# Altium project BLE_ADS.PrjPcb
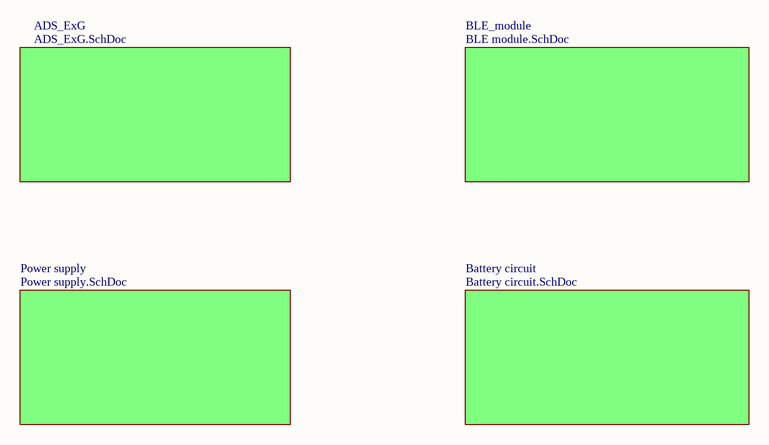
[diagram p0: BLE_ADS.SchDoc]
5 sheets, 104 parts. Net scope: global (net labels, ports and power ports of the same name join across sheets).
Board files: BLE_ADS_062819.PcbDoc, Power.PcbDoc, ADS.PcbDoc, BLE_ADS_ver02.PcbDoc
Sheets:
  BLE_ADS.SchDoc
    ADS_ExG = ADS_ExG.SchDoc
    BLE_module = BLE module.SchDoc
    Power supply = Power supply.SchDoc
    Battery circuit = Battery circuit.SchDoc

## Sheet BLE_ADS.SchDoc
size A

### Sub-sheets
ADS_ExG = ADS_ExG.SchDoc: no entries
Battery circuit = Battery circuit.SchDoc: no entries
BLE_module = BLE module.SchDoc: no entries
Power supply = Power supply.SchDoc: no entries

## Sheet ADS_ExG.SchDoc: ADS_ExG
size A; DrawnBy: Tai Le; Revision: Ver01
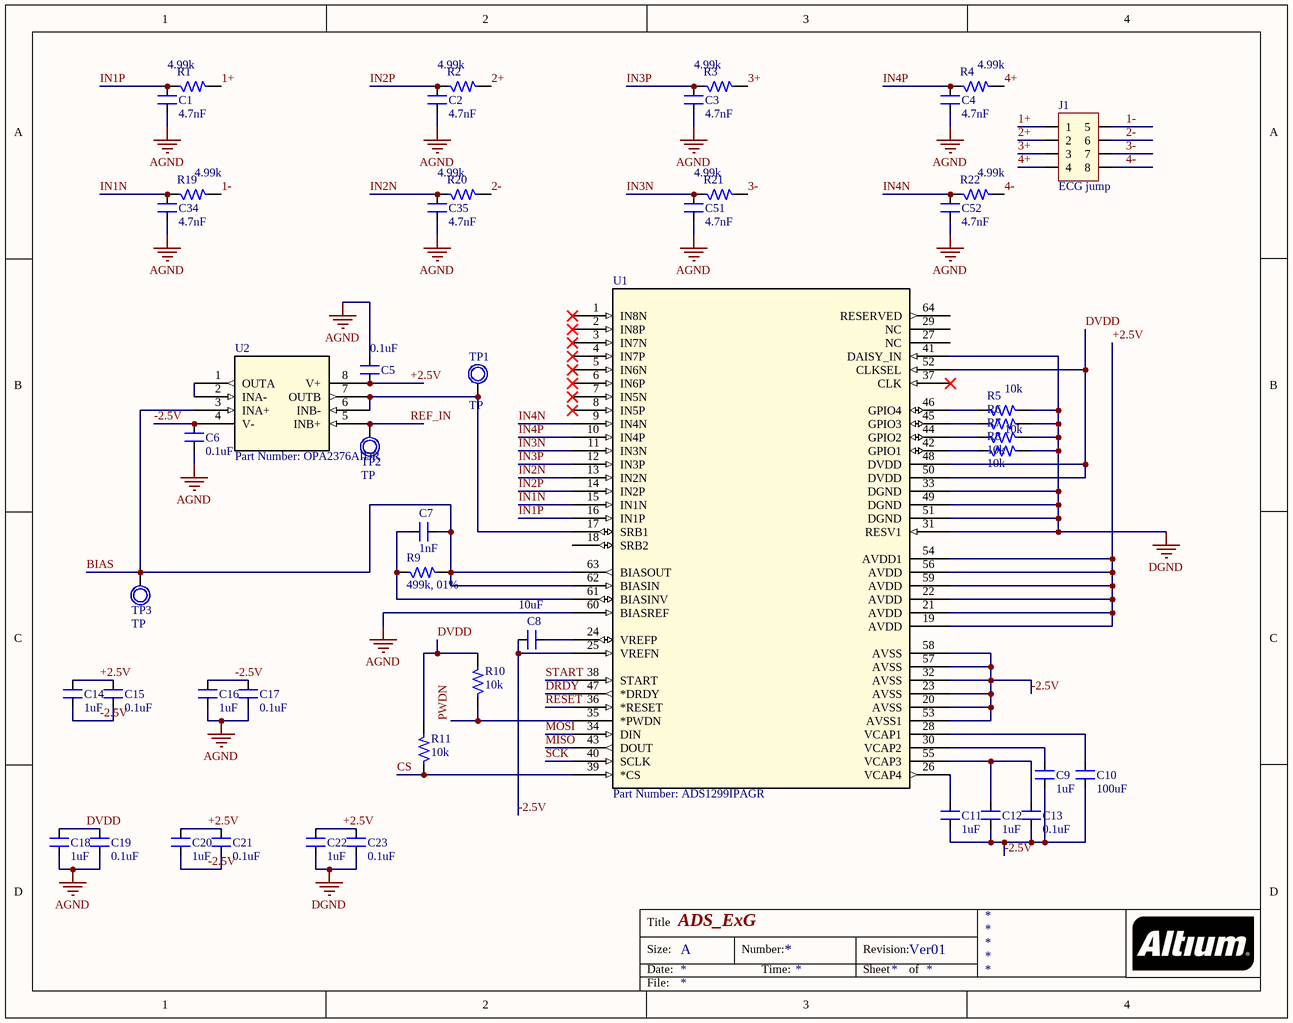
[diagram p1: ADS_ExG.SchDoc]

### Parts
C1  4.7nF  [SM-0805]
C2  4.7nF  [SM-0805]
C3  4.7nF  [SM-0805]
C4  4.7nF  [SM-0805]
C5  0.1uF  [SM-0805]
C6  0.1uF  [SM-0805]
C7  1nF  [SM-0805]
C8  10uF  [SM-0805]
C9  1uF  [SM-0805]
C10  100uF  [SM-0805]
C11  1uF  [SM-0805]
C12  1uF  [SM-0805]
C13  0.1uF  [SM-0805]
C14  1uF  [SM-0805]
C15  0.1uF  [SM-0805]
C16  1uF  [SM-0805]
C17  0.1uF  [SM-0805]
C18  1uF  [SM-0805]
C19  0.1uF  [SM-0805]
C20  1uF  [SM-0805]
C21  0.1uF  [SM-0805]
C22  1uF  [SM-0805]
C23  0.1uF  [SM-0805]
C34  4.7nF  [SM-0805]
C35  4.7nF  [SM-0805]
C51  4.7nF  [SM-0805]
C52  4.7nF  [SM-0805]
J1  ECG jump  [JP4x2]
R1  4.99k  [SM-0805]
R2  4.99k  [SM-0805]
R3  4.99k  [SM-0805]
R4  4.99k  [SM-0805]
R5  10k  [SM-0805]
R6  10k  [SM-0805]
R7  10k  [SM-0805]
R8  10k  [SM-0805]
R9  499k, 01%  [SM-0805]
R10  10k  [SM-0805]
R11  10k  [SM-0805]
R19  4.99k  [SM-0805]
R20  4.99k  [SM-0805]
R21  4.99k  [SM-0805]
R22  4.99k  [SM-0805]
TP1  TP  [TP1]
TP2  TP  [TP1]
TP3  TP  [TP1]
U1  Part Number: ADS1299IPAGR  [PAG64]
U2  Part Number: OPA2376AIDR  [D8]

### Nets
AGND: C1.1 C2.1 C3.1 C4.1 C5.2 C6.1 C16.1 C17.1 C18.1 C19.1 C34.1 C35.1 C51.1 C52.1 U1.60(BIASREF)
DGND: C22.1 C23.1 R5.2 R6.2 R7.2 R8.2 U1.31(RESV1) U1.33(DGND) U1.41(DAISY_IN) U1.49(DGND) U1.51(DGND)
1+: J1.1 R1.2
1-: J1.5 R19.2
2+: J1.2 R2.2
2-: J1.6 R20.2
3+: J1.3 R3.2
3-: J1.7 R21.2
4+: J1.4 R4.2
4-: J1.8 R22.2
+2.5V: C5.1 C14.2 C15.2 C20.2 C21.2 C22.2 C23.2 U1.19(AVDD) U1.21(AVDD) U1.22(AVDD) U1.54(AVDD1) U1.56(AVDD) U1.59(AVDD) U2.8(V+)
-2.5V: C6.2 C8.2 C9.1 C10.2 C11.1 C12.1 C13.1 C14.1 C15.1 C16.2 C17.2 C20.1 C21.1 U1.20(AVSS) U1.23(AVSS) U1.25(VREFN) U1.32(AVSS) U1.53(AVSS1) U1.57(AVSS) U1.58(AVSS) U2.4(V-)
BIAS: C7.2 R9.2 TP3.1 U1.62(BIASIN) U1.63(BIASOUT) U2.3(INA+)
CS: R11.1 U1.39(*CS)
DRDY: U1.47(*DRDY)
DVDD: C18.2 C19.2 R10.2 R11.2 U1.48(DVDD) U1.50(DVDD) U1.52(CLKSEL)
IN1N: C34.2 R19.1 U1.15(IN1N)
IN1P: C1.2 R1.1 U1.16(IN1P)
IN2N: C35.2 R20.1 U1.13(IN2N)
IN2P: C2.2 R2.1 U1.14(IN2P)
IN3N: C51.2 R21.1 U1.11(IN3N)
IN3P: C3.2 R3.1 U1.12(IN3P)
IN4N: C52.2 R22.1 U1.9(IN4N)
IN4P: C4.2 R4.1 U1.10(IN4P)
MISO: U1.43(DOUT)
MOSI: U1.34(DIN)
PWDN: R10.1 U1.35(*PWDN)
REF_IN: TP2.1 U2.5(INB+)
RESET: U1.36(*RESET)
SCK: U1.40(SCLK)
START: U1.38(START)
NetC7_1: C7.1 R9.1 U1.61(BIASINV)
NetC8_1: C8.1 U1.24(VREFP)
NetC9_2: C9.2 U1.30(VCAP2)
NetC10_1: C10.1 U1.28(VCAP1)
NetC11_2: C11.2 U1.26(VCAP4)
NetC12_2: C12.2 C13.2 U1.55(VCAP3)
NetR5_1: R5.1 U1.46(GPIO4)
NetR6_1: R6.1 U1.45(GPIO3)
NetR7_1: R7.1 U1.44(GPIO2)
NetR8_1: R8.1 U1.42(GPIO1)
NetTP1_1: TP1.1 U1.17(SRB1) U2.6(INB-) U2.7(OUTB)
NetU2_1: U2.1(OUTA) U2.2(INA-)

Not connected (* = marked no-connect by the designer): U1 1(IN8N)* 2(IN8P)* 3(IN7N)* 4(IN7P)* 5(IN6N)* 6(IN6P)* 7(IN5N)* 8(IN5P)* 18(SRB2) 27(NC) 29(NC) 37(CLK)* 64(RESERVED)

### Notes on the sheet
- Title
- Size:
- Date:
- A
- Number:
- Time:
- Revision:
- Sheet
- of
- File:

### Library data of the parts
C1-C23 C34 C35 C51 C52 = CM: Cap SMD; Value: 103
J1 = JP4x2: Connector 4x2; Value: Connector 4x2
R1-R11 R19-R22 = R: Resistor 1/4W; Value: R1/4W - 1K
TP1-TP3 = TP1: Test Point; Value: Test Point
U1 = ADS1299IPAGR: No Description Available; Vendor: Texas Instruments; Built_By: EMA_UL_Team; Manufacturer_Part_Number: ADS1299IPAGR; Copyright: Copyright (C) 2018 Accelerated Designs. All rights reserved; RefDes: RefDes; Type: DEV; Value: Value
U2 = OPA2376AIDR: No Description Available; Vendor: Texas Instruments; Built_By: EMA_UL_Team; Manufacturer_Part_Number: OPA2376AIDR; Copyright: Copyright (C) 2018 Accelerated Designs. All rights reserved; RefDes: RefDes; Type: DEV; Value: Value

## Sheet BLE module.SchDoc
size A
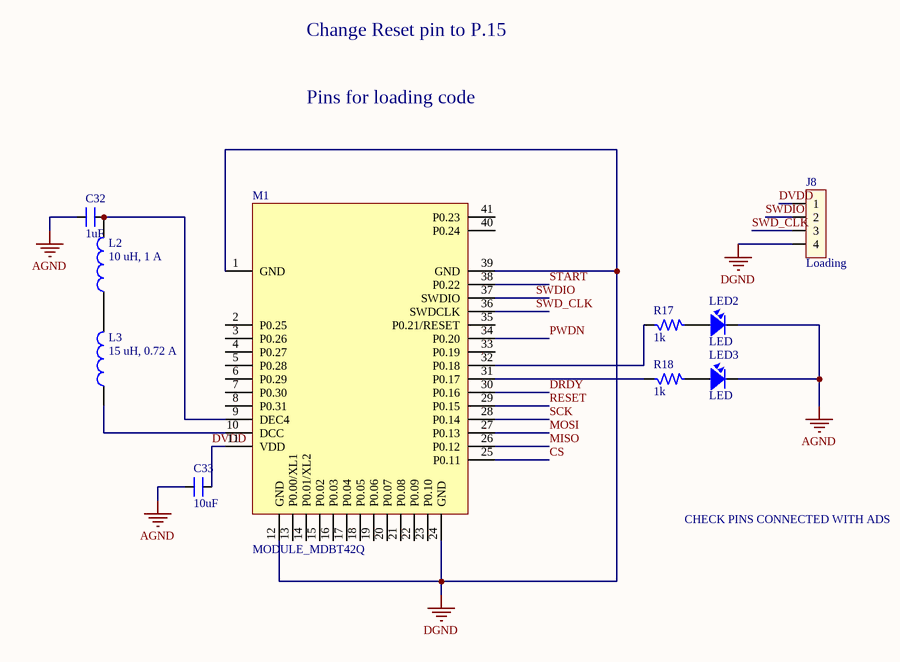
[diagram p2: BLE module.SchDoc]

### Parts
C32  1uF  [SM-0805]
C33  10uF  [SM-0805]
J8  Loading  [JP4]
L2  10 uH, 1 A  [WE-TPC_2828]
L3  15 uH, 0.72 A  [WE-TPC_2828]
LED2  LED  [SM-0805]
LED3  LED  [SM-0805]
M1  MODULE_MDBT42Q  [PCB_MDBT42Q_10X16]
R17  1k  [SM-0805]
R18  1k  [SM-0805]

### Nets
AGND: C32.1 C33.1 LED2.2 LED3.2
DGND: J8.4 M1.1(GND) M1.12(GND) M1.24(GND) M1.39(GND)
CS: M1.25(P0.11)
DRDY: M1.30(P0.16)
DVDD: C33.2 J8.1 M1.11(VDD)
MISO: M1.26(P0.12)
MOSI: M1.27(P0.13)
PWDN: M1.34(P0.20)
RESET: M1.29(P0.15)
SCK: M1.28(P0.14)
START: M1.38(P0.22)
SWD_CLK: J8.3 M1.36(SWDCLK)
SWDIO: J8.2 M1.37(SWDIO)
NetC32_2: C32.2 L2.2 M1.9(DEC4)
NetL2_1: L2.1 L3.2
NetL3_1: L3.1 M1.10(DCC)
NetLED2_1: LED2.1 R17.2
NetLED3_1: LED3.1 R18.2
NetM1_31: M1.31(P0.17) R18.1
NetM1_32: M1.32(P0.18) R17.1

Not connected (* = marked no-connect by the designer): M1 2(P0.25) 3(P0.26) 4(P0.27) 5(P0.28) 6(P0.29) 7(P0.30) 8(P0.31) 13(P0.00/XL1) 14(P0.01/XL2) 15(P0.02) 16(P0.03) 17(P0.04) 18(P0.05) 19(P0.06) 20(P0.07) 21(P0.08) 22(P0.09) 23(P0.10) 33(P0.19) 35(P0.21/RESET) 40(P0.24) 41(P0.23)

### Notes on the sheet
- Change Reset pin to P.15
- Pins for loading code
- CHECK PINS CONNECTED WITH ADS

### Library data of the parts
C32 C33 = CM: Cap SMD; Value: 103
J8 = JP4: Connector 4; Value: Connector 4x2
L2 = 744025100: SMT Shielded Tiny Power Inductor WE-TPC, size 2828, 10 uH, 1 A; Rated Current: 1 A; Inductance: 10 uH; DC Resistance max.: 190 mOhm; Self Resonant Frequency: 41 MHz; Saturation Current: 1.1 A; ComponentLink1Description: Manufacturer; ComponentLink1URL: http://www.we-online.de; ComponentLink2Description: Datasheet; ComponentLink2URL: https://katalog.we-online.com/pbs/datasheet/744025100.pdf; Part Number: 744025100; Published Date: December 2018; Publisher: Wurth Elektronik; Size: 2828; Operating Temperature: -40 to +125 degC; Mounting Technology: SMT; Packaging: Tape and Reel
L3 = 744025150: SMT Shielded Tiny Power Inductor WE-TPC, size 2828, 15 uH, 0.72 A; Rated Current: 0.72 A; Inductance: 15 uH; DC Resistance max.: 400 mOhm; Self Resonant Frequency: 32 MHz; Saturation Current: 0.9 A; ComponentLink1Description: Manufacturer; ComponentLink1URL: http://www.we-online.de; ComponentLink2Description: Datasheet; ComponentLink2URL: https://katalog.we-online.com/pbs/datasheet/744025150.pdf; Part Number: 744025150; Published Date: December 2018; Publisher: Wurth Elektronik; Size: 2828; Operating Temperature: -40 to +125 degC; Mounting Technology: SMT; Packaging: Tape and Reel
LED2 LED3 = LED: LED Single colour Green and Red; Value: LED 3 ly Single Colour
M1 = MODULE_MDBT42Q: MDBT42Q
R17 R18 = R: Resistor 1/4W; Value: R1/4W - 1K

## Sheet Power supply.SchDoc
size A
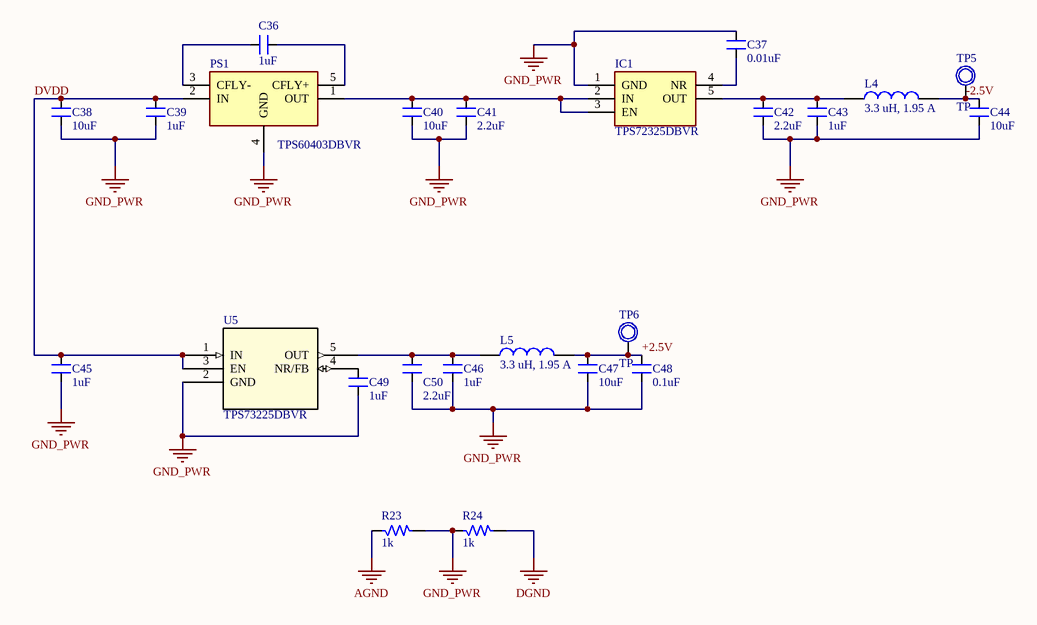
[diagram p3: Power supply.SchDoc]

### Parts
C36  1uF  [SM-0805]
C37  0.01uF  [SM-0805]
C38  10uF  [SM-0805]
C39  1uF  [SM-0805]
C40  10uF  [SM-0805]
C41  2.2uF  [SM-0805]
C42  2.2uF  [SM-0805]
C43  1uF  [SM-0805]
C44  10uF  [SM-0805]
C45  1uF  [SM-0805]
C46  1uF  [SM-0805]
C47  10uF  [SM-0805]
C48  0.1uF  [SM-0805]
C49  1uF  [SM-0805]
C50  2.2uF  [SM-0805]
IC1  TPS72325DBVR  [SOT95P280X145-5N]
L4  3.3 uH, 1.95 A  [WE-TPC_4818]
L5  3.3 uH, 1.95 A  [WE-TPC_4818]
PS1  TPS60403DBVR  [SOT95P280X145-5N]
R23  1k  [SM-0805]
R24  1k  [SM-0805]
TP5  TP  [TP1]
TP6  TP  [TP1]
U5  TPS73225DBVR  [DBV5]

### Nets
AGND: R23.1
DGND: R24.2
GND_PWR: C37.2 C38.1 C39.1 C40.1 C41.1 C42.1 C43.1 C44.1 C45.1 C46.1 C47.1 C48.1 C49.1 C50.1 IC1.1(GND) PS1.4(GND) R23.2 R24.1 U5.2(GND)
+2.5V: C47.2 C48.2 L5.2 TP6.1
-2.5V: C44.2 L4.2 TP5.1
DVDD: C38.2 C39.2 C45.2 PS1.2(IN) U5.1(IN) U5.3(EN)
NetC36_1: C36.1 PS1.5(CFLY+)
NetC36_2: C36.2 PS1.3(CFLY-)
NetC37_1: C37.1 IC1.4(NR)
NetC40_2: C40.2 C41.2 IC1.2(IN) IC1.3(EN) PS1.1(OUT)
NetC42_2: C42.2 C43.2 IC1.5(OUT) L4.1
NetC46_2: C46.2 C50.2 L5.1 U5.5(OUT)
NetC49_2: C49.2 U5.4(NR/FB)

### Library data of the parts
C36-C50 = CM: Cap SMD; Value: 103
IC1 = TPS72325DBVR: Integrated Circuit; Manufacturer_Name: Texas Instruments; Datasheet Link: http://www.mouser.com/ds/2/405/tps723-558413.pdf; Height: 1.45mm; Mouser Part Number: 595-TPS72325DBVR; Mouser Price/Stock: https://www.mouser.com/Search/Refine.aspx?Keyword=595-TPS72325DBVR; Manufacturer_Part_Number: TPS72325DBVR
L4 L5 = 744042003: SMT Shielded Tiny Power Inductor WE-TPC, size 4818, 3.3 uH, 1.95 A; Rated Current: 1.95 A; Inductance: 3.3 uH; DC Resistance max.: 65 mOhm; Self Resonant Frequency: 80 MHz; Saturation Current: 1.8 A; ComponentLink1Description: Manufacturer; ComponentLink1URL: http://www.we-online.de; ComponentLink2Description: Datasheet; ComponentLink2URL: https://katalog.we-online.com/pbs/datasheet/744042003.pdf; Part Number: 744042003; Published Date: December 2018; Publisher: Wurth Elektronik; Size: 4818; Operating Temperature: -40 to +125 degC; Mounting Technology: SMT; Packaging: Tape and Reel
PS1 = TPS60403DBVR: Power Supply; Manufacturer_Name: Texas Instruments; Datasheet Link: http://www.ti.com/lit/gpn/tps60403; Height: 1.45mm; Mouser Part Number: 595-TPS60403DBVR; Mouser Price/Stock: https://www.mouser.com/Search/Refine.aspx?Keyword=595-TPS60403DBVR; Manufacturer_Part_Number: TPS60403DBVR
R23 R24 = R: Resistor 1/4W; Value: R1/4W - 1K
TP5 TP6 = TP1: Test Point; Value: Test Point
U5 = TPS73225DBVR: No Description Available; Vendor: Texas Instruments; Built_By: EMA_UL_Team; Manufacturer_Part_Number: TPS73225DBVR; Manufacturer: Texas Instruments; Copyright: Copyright (C) 2018 Accelerated Designs. All rights reserved; RefDes: RefDes; Type: DEV; Value: Value

## Sheet Battery circuit.SchDoc
size A
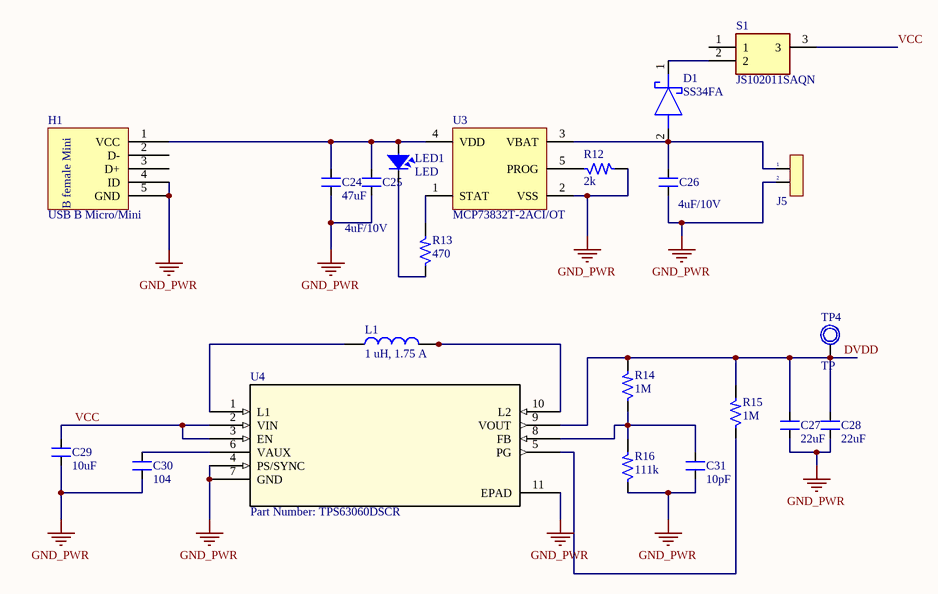
[diagram p4: Battery circuit.SchDoc]

### Parts
C24  47uF  [SM-0805]
C25  4uF/10V  [SM-0805]
C26  4uF/10V  [SM-0805]
C27  22uF  [SM-0805]
C28  22uF  [SM-0805]
C29  10uF  [SM-0805]
C30  104  [SM-0805]
C31  10pF  [SM-0805]
D1  SS34FA  [SODFL3618X143N]
H1  USB B Micro/Mini  [USB-B-MICRO-female Tai02]
J5  Jumper 2  [J2_Jst SH_1mm]  (value not drawn)
L1  1 uH, 1.75 A  [WE-TPC_2811]
LED1  LED  [SM-0805]
R12  2k  [SM-0805]
R13  470  [SM-0805]
R14  1M  [SM-0805]
R15  1M  [SM-0805]
R16  111k  [SM-0805]
S1  JS102011SAQN  [JS102011SAQN]
TP4  TP  [TP1]
U3  MCP73832T-2ACI/OT  [SOT-23-OT5_N]
U4  Part Number: TPS63060DSCR  [DSC10_1P70X2P15]

### Nets
GND_PWR: C24.1 C25.1 C26.1 C27.1 C28.1 C29.1 C30.1 C31.1 H1.4(ID) H1.5(GND) J5.2 R12.2 R16.1 U3.2(VSS) U4.4(PS/SYNC) U4.7(GND) U4.11(EPAD)
DVDD: C27.2 C28.2 R14.2 R15.2 TP4.1 U4.9(VOUT)
VCC: C29.2 S1.3 U4.2(VIN) U4.3(EN)
NetC24_2: C24.2 C25.2 H1.1(VCC) LED1.1 U3.4(VDD)
NetC26_2: C26.2 D1.2(A) J5.1 U3.3(VBAT)
NetC30_2: C30.2 U4.6(VAUX)
NetC31_2: C31.2 R14.1 R16.2 U4.8(FB)
NetD1_1: D1.1(K) S1.2
NetL1_1: L1.1 U4.1(L1)
NetL1_2: L1.2 U4.10(L2)
NetLED1_2: LED1.2 R13.1
NetR12_1: R12.1 U3.5(PROG)
NetR13_2: R13.2 U3.1(STAT)
NetR15_1: R15.1 U4.5(PG)

Not connected (* = marked no-connect by the designer): H1 2(D-) 3(D+); S1 1

### Notes on the sheet
- (in symbol USB B Female Micro/Mini SMD) B female Mini

### Library data of the parts
C24-C31 = CM: Cap SMD; Value: 103
D1 = SS34FA: Schottky Diode; Manufacturer_Name: ON Semiconductor; Datasheet Link: https://componentsearchengine.com/Datasheets/1/SS34FA.pdf; Height: 1.43mm; Mouser Part Number: 512-SS34FA; Mouser Price/Stock: https://www.mouser.com/Search/Refine.aspx?Keyword=512-SS34FA; Manufacturer_Part_Number: SS34FA
H1 = USB B Female Micro/Mini SMD
J5 = JP 2: Value: JP 2
L1 = 744028001: SMT Shielded Tiny Power Inductor WE-TPC, size 2811, 1 uH, 1.75 A; Rated Current: 1.75 A; Inductance: 1 uH; DC Resistance max.: 85 mOhm; Self Resonant Frequency: 150 MHz; Saturation Current: 1.5 A; ComponentLink1Description: Manufacturer; ComponentLink1URL: http://www.we-online.de; ComponentLink2Description: Datasheet; ComponentLink2URL: https://katalog.we-online.com/pbs/datasheet/744028001.pdf; Part Number: 744028001; Published Date: December 2018; Publisher: Wurth Elektronik; Size: 2811; Operating Temperature: -40 to +125 degC; Mounting Technology: SMT; Packaging: Tape and Reel
LED1 = LED: as LED2 on sheet BLE module
R12-R16 = R: Resistor 1/4W; Value: R1/4W - 1K
S1 = JS102011SAQN: Switch; Manufacturer_Name: C & K COMPONENTS; Allied_Number: 71173976; Datasheet Link: http://www.ckswitches.com/media/1422/js.pdf; Manufacturer_Part_Number: JS102011SAQN; Mouser Part Number: 611-JS102011SAQN; Mouser Price/Stock: https://www.mouser.com/Search/Refine.aspx?Keyword=611-JS102011SAQN; RS Part Number: 1543603; RS Price/Stock: http://uk.rs-online.com/web/p/products/1543603; Allied Price/Stock: https://www.alliedelec.com/c-k-js102011saqn/71173976/
TP4 = TP1: Test Point; Value: Test Point
U3 = MCP73832T-2ACI/OT: Miniature Single-Cell, Fully Integrated Li-Ion, Li-Polymer Charge Management Controller, 4.2V, 5-Pin SOT-23, Industrial Temperature, Tape and Reel; Published: 29-Jan-2009; LatestRevisionDate: 27-Nov-2009; LatestRevisionNote: Updated to datasheet revision E, Sep-2008; DatasheetVersion: revE, Sep-2008; PackageVersion: revBB, Aug-2009; PackageReference: SOT-23-OT5; Publisher: Altium Limited; PackageDescription: 5-Lead Plastic Small Outline Transistor (OT) [SOT-23]; Supplier 1: Digi-Key; Supplier Part Number 1: MCP73832T-2ACI/OTTR-ND; Supplier 2: Digi-Key; Supplier Part Number 2: MCP73832T-2ACI/OTCT-ND; Supplier 3: Digi-Key; Supplier Part Number 3: MCP73832T-2ACI/OTDKR-ND; Supplier 4: Farnell; Supplier Part Number 4: 1332159; Code_IPC: SOT23-5; ComponentLink1Description: Datasheet; ComponentLink1URL: http://ww1.microchip.com/downloads/en/DeviceDoc/21984e.pdf; ComponentLink2Description: Packaging Specification; ComponentLink2URL: http://www.microchip.com/stellent/groups/techpub_sg/documents/packagingspec/en012702.pdf; ComponentLink3Description: Microchip.com Home; ComponentLink3URL: http://www.microchip.com/
U4 = TPS63060DSCR: No Description Available; Vendor: Texas Instruments; Built_By: EMA_UL_Team; Manufacturer_Part_Number: TPS63060DSCR; Manufacturer: Texas Instruments; Copyright: Copyright (C) 2018 Accelerated Designs. All rights reserved; RefDes: RefDes; Type: DEV; Value: Value

## Nets that join several sheets
AGND: ADS_ExG (15 pins), BLE module (C32.1 C33.1 LED2.2 LED3.2), Power supply (R23.1)
DGND: ADS_ExG (11 pins), BLE module (5 pins), Power supply (R24.2)
GND_PWR: Power supply (19 pins), Battery circuit (17 pins)
+2.5V: ADS_ExG (14 pins), Power supply (C47.2 C48.2 L5.2 TP6.1)
-2.5V: ADS_ExG (21 pins), Power supply (C44.2 L4.2 TP5.1)
CS: ADS_ExG (R11.1 U1.39), BLE module (M1.25)
DRDY: ADS_ExG (U1.47), BLE module (M1.30)
DVDD: ADS_ExG (7 pins), BLE module (C33.2 J8.1 M1.11), Power supply (6 pins), Battery circuit (6 pins)
MISO: ADS_ExG (U1.43), BLE module (M1.26)
MOSI: ADS_ExG (U1.34), BLE module (M1.27)
PWDN: ADS_ExG (R10.1 U1.35), BLE module (M1.34)
RESET: ADS_ExG (U1.36), BLE module (M1.29)
SCK: ADS_ExG (U1.40), BLE module (M1.28)
START: ADS_ExG (U1.38), BLE module (M1.38)